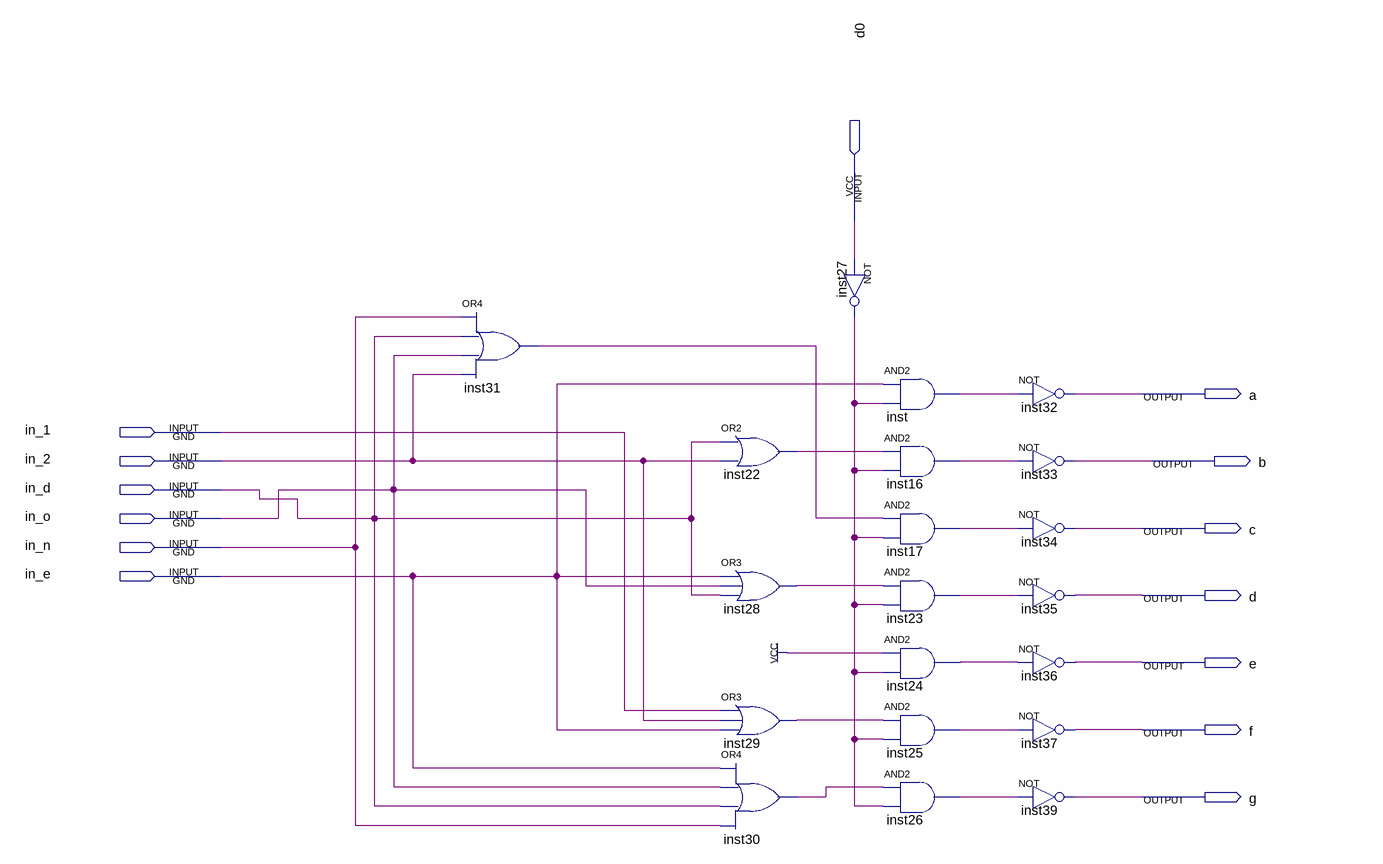
[diagram p0: schematic sheet]
// Quartus schematic display_utils.bdf as structural Verilog: 20 symbols, 14 pins
module display_utils (
  input  d0,
  input  in_1,
  input  in_2,
  input  in_d,
  input  in_o,
  input  in_n,
  input  in_e,
  output a,
  output b,
  output c,
  output d,
  output e,
  output f,
  output g
);

  wire inst16_out, inst17_out, inst22_out, inst23_out, inst24_out, inst25_out, inst26_out, inst27_out,
       inst28_out, inst29_out, inst30_out, inst31_out, inst_out;

  or inst31 (inst31_out, in_n, in_d, in_o, in_2);
  or inst22 (inst22_out, in_d, in_2);
  or inst28 (inst28_out, in_e, in_o, in_d);
  or inst29 (inst29_out, in_1, in_2, in_e);
  or inst30 (inst30_out, in_e, in_o, in_d, in_n);
  not inst27 (inst27_out, d0);
  and inst (inst_out, in_e, inst27_out);
  and inst16 (inst16_out, inst22_out, inst27_out);
  and inst17 (inst17_out, inst31_out, inst27_out);
  and inst23 (inst23_out, inst28_out, inst27_out);
  and inst24 (inst24_out, 1'b1, inst27_out);
  and inst25 (inst25_out, inst29_out, inst27_out);
  and inst26 (inst26_out, inst30_out, inst27_out);
  not inst32 (a, inst_out);
  not inst33 (b, inst16_out);
  not inst34 (c, inst17_out);
  not inst35 (d, inst23_out);
  not inst36 (e, inst24_out);
  not inst37 (f, inst25_out);
  not inst39 (g, inst26_out);
endmodule
